# Altium schematic sheet Schematic5.SchDoc
size A4
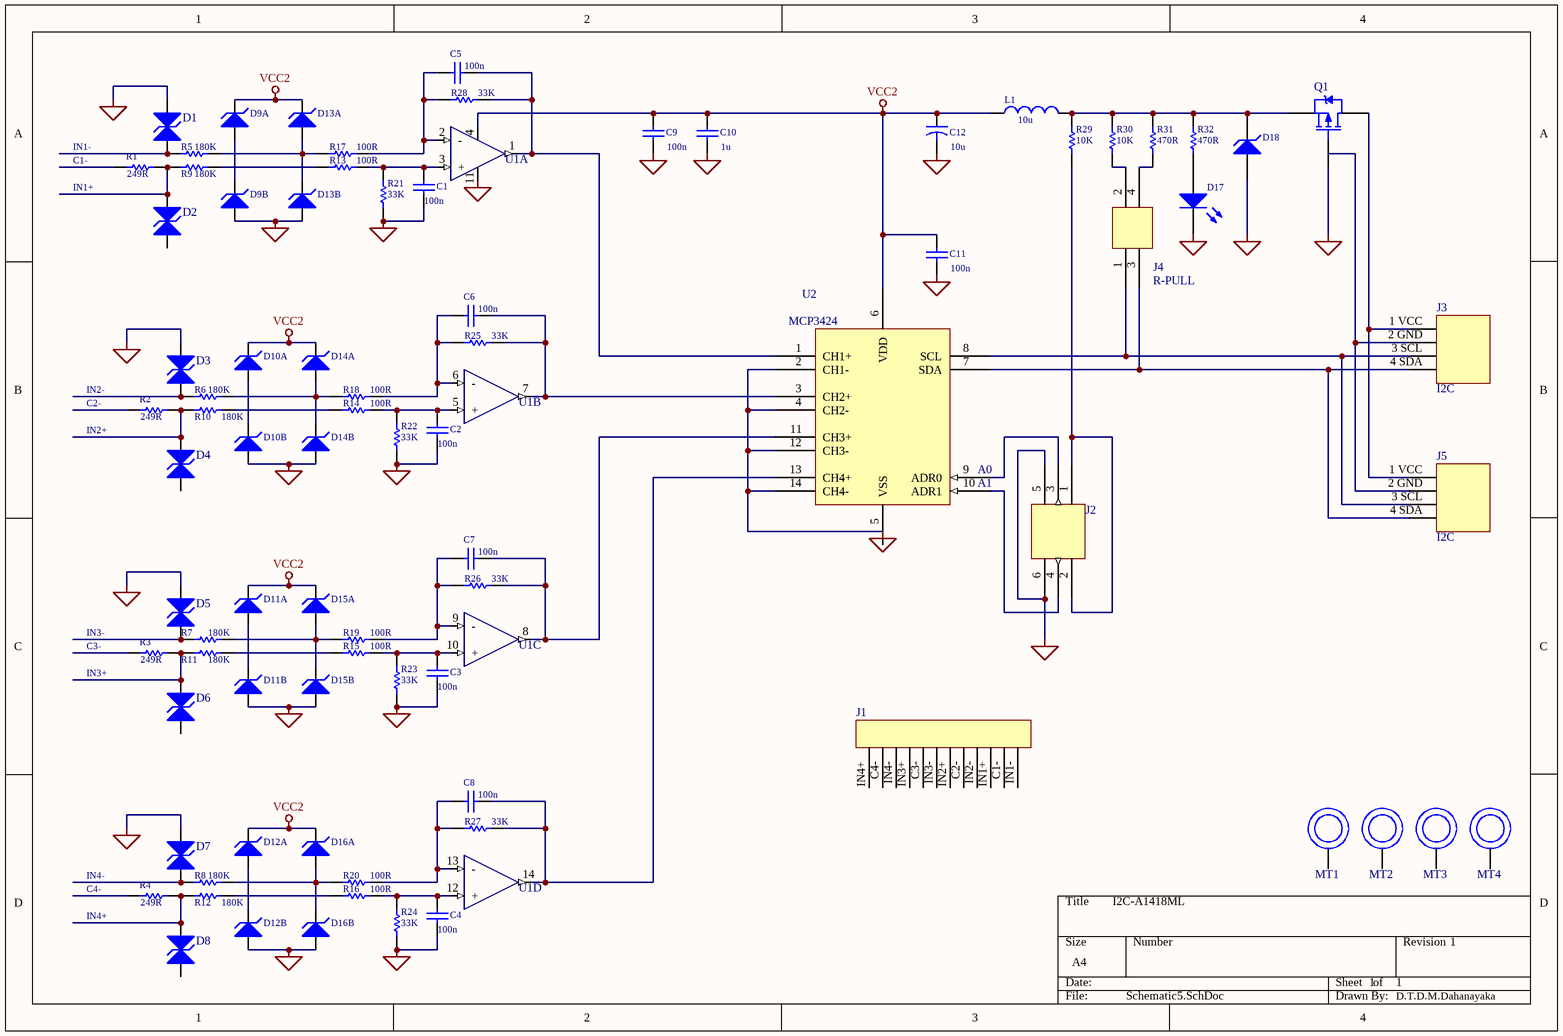
[diagram p0: Schematic5.SchDoc]

## Parts
C1  value 100n  [RAD-0.3]  (hidden comment: Cap)
C2  value 100n  [RAD-0.3]  (hidden comment: Cap)
C3  value 100n  [RAD-0.3]  (hidden comment: Cap)
C4  value 100n  [RAD-0.3]  (hidden comment: Cap)
C5  value 100n  [RAD-0.3]
C6  value 100n  [RAD-0.3]
C7  value 100n  [RAD-0.3]
C8  value 100n  [RAD-0.3]
C9  value 100n  [RAD-0.3]  (hidden comment: Cap)
C10  value 1u  [RAD-0.3]  (hidden comment: Cap)
C11  value 100n  [RAD-0.3]  (hidden comment: Cap)
C12  value 10u  [CAPR5-4X5]  (hidden comment: Cap2)
D1  (no value)  [DO-41B]
D2  (no value)  [DO-41B]
D3  (no value)  [DO-41B]
D4  (no value)  [DO-41B]
D5  (no value)  [DO-41B]
D6  (no value)  [DO-41B]
D7  (no value)  [DO-41B]
D8  (no value)  [DO-41B]
D9A  (no value)  [DO-41B]
D9B  (no value)  [DO-41B]
D10A  (no value)  [DO-41B]
D10B  (no value)  [DO-41B]
D11  ZY150  [DO-41B]  (value not drawn)
D11A  (no value)  [DO-41B]
D11B  (no value)  [DO-41B]
D12A  (no value)  [DO-41B]
D12B  (no value)  [DO-41B]
D13A  (no value)  [DO-41B]
D13B  (no value)  [DO-41B]
D14A  (no value)  [DO-41B]
D14B  (no value)  [DO-41B]
D15A  (no value)  [DO-41B]
D15B  (no value)  [DO-41B]
D16A  (no value)  [DO-41B]
D16B  (no value)  [DO-41B]
D17  LED1  [LED-1]  (value not drawn)
D18  (no value)  [DO-41B]
D22  (no value)  [DO-41B]
D33  ZY150  [DO-41B]  (value not drawn)
D44  (no value)  [DO-41B]
D55  ZY150  [DO-41B]  (value not drawn)
D66  (no value)  [DO-41B]
D77  ZY150  [DO-41B]  (value not drawn)
D88  (no value)  [DO-41B]
J1  (no value)
J2  (no value)
J3  I2C
J4  R-PULL
J5  I2C
L1  value 10u  [0402-A]  (hidden comment: Inductor)
MT1  Component_1  (value not drawn)
MT2  (no value)
MT3  (no value)
MT4  (no value)
Q1  (no value)  [TO-220AB]
R1  value 249R  [AXIAL-0.3]
R2  value 249R  [AXIAL-0.3]
R3  value 249R  [AXIAL-0.3]
R4  value 249R  [AXIAL-0.3]
R5  value 180K  [AXIAL-0.3]
R6  value 180K  [AXIAL-0.3]
R7  value 180K  [AXIAL-0.3]
R8  value 180K  [AXIAL-0.3]
R9  value 180K  [AXIAL-0.3]
R10  value 180K  [AXIAL-0.3]
R11  value 180K  [AXIAL-0.3]
R12  value 180K  [AXIAL-0.3]
R13  value 100R  [AXIAL-0.3]
R14  value 100R  [AXIAL-0.3]
R15  value 100R  [AXIAL-0.3]
R16  value 100R  [AXIAL-0.3]
R17  value 100R  [AXIAL-0.3]
R18  value 100R  [AXIAL-0.3]
R19  value 100R  [AXIAL-0.3]
R20  value 100R  [AXIAL-0.3]
R21  value 33K  [AXIAL-0.3]
R22  value 33K  [AXIAL-0.3]
R23  value 33K  [AXIAL-0.3]
R24  value 33K  [AXIAL-0.3]
R25  value 33K  [AXIAL-0.3]
R26  value 33K  [AXIAL-0.3]
R27  value 33K  [AXIAL-0.3]
R28  value 33K  [AXIAL-0.3]
R29  value 10K  [AXIAL-0.3]
R30  value 10K  [AXIAL-0.3]
R31  value 470R  [AXIAL-0.3]
R32  value 470R  [AXIAL-0.3]
U1A  (no value)
U1B  (no value)
U1C  (no value)
U1D  (no value)
U2  MCP3424

## Nets
NetC1_1: C1.1 C2.1 C3.1 C4.1 C9.1 C10.1 C11.1 C12.2 D1.1(A) D3.1(A) D5.1(A) D7.1(A) D9B.1(A) D10B.1(A) D11B.1(A) D12B.1(A) D13B.1(A) D14B.1(A) D15B.1(A) D16B.1(A) D17.2(K) D18.1(A) J2.5 J2.6 Q1.1(G) R21.1 R22.1 R23.1 R24.1 U1A.11 U2.2(CH1-) U2.4(CH2-) U2.12(CH3-) U2.14(CH4-)
VCC2: C9.2 C10.2 C11.2 C12.1 D9A.2(K) D10A.2(K) D11A.2(K) D12A.2(K) D13A.2(K) D14A.2(K) D15A.2(K) D16A.2(K) L1.1 U1A.4 U2.6(VDD)
NetC1_2: C1.2 R13.2 R21.2 U1A.3(+)
NetC2_2: C2.2 R14.2 R22.2 U1B.5(+)
NetC3_2: C3.2 R15.2 R23.2 U1C.10(+)
NetC4_2: C4.2 R16.2 R24.2 U1D.12(+)
NetC5_1: C5.1 R17.2 R28.1 U1A.2(-)
NetC5_2: C5.2 R28.2 U1A.1 U2.1(CH1+)
NetC6_1: C6.1 R18.2 R25.1 U1B.6(-)
NetC6_2: C6.2 R25.2 U1B.7 U2.3(CH2+)
NetC7_1: C7.1 R19.2 R26.1 U1C.9(-)
NetC7_2: C7.2 R26.2 U1C.8 U2.11(CH3+)
NetC8_1: C8.1 R20.2 R27.1 U1D.13(-)
NetC8_2: C8.2 R27.2 U1D.14 U2.13(CH4+)
NetD1_2: D1.2(K) D11.2(K)
NetD2_1: D2.1(A) R1.2 R9.1
NetD3_2: D3.2(K) D33.2(K)
NetD4_1: D4.1(A) R2.2 R10.1
NetD5_2: D5.2(K) D55.2(K)
NetD6_1: D6.1(A) R3.2 R11.1
NetD7_2: D7.2(K) D77.2(K)
NetD8_1: D8.1(A) R4.2 R12.1
NetD9A_1: D9A.1(A) D9B.2(K)
NetD10A_1: D10A.1(A) D10B.2(K)
NetD11_1: D11.1(A) R5.1
NetD11A_1: D11A.1(A) D11B.2(K)
NetD12A_1: D12A.1(A) D12B.2(K)
NetD13A_1: D13A.1(A) D13B.2(K) R5.2 R17.1
NetD14A_1: D14A.1(A) D14B.2(K) R6.2 R18.1
NetD15A_1: D15A.1(A) D15B.2(K) R7.2 R19.1
NetD16A_1: D16A.1(A) D16B.2(K) R8.2 R20.1
NetD17_1: D17.1(A) R32.1
NetD18_2: D18.2(K) L1.2 Q1.3(S) R29.2 R30.2 R31.2 R32.2
NetD33_1: D33.1(A) R6.1
NetD55_1: D55.1(A) R7.1
NetD77_1: D77.1(A) R8.1
NetJ2_1: J2.1 J2.2 R29.1
NetJ2_3: J2.3 U2.9(ADR0)
NetJ2_4: J2.4 U2.10(ADR1)
NetJ3_1 VCC: J3.1_VCC J5.1_VCC Q1.2(D)
NetJ3_2 GND: J3.2_GND J5.2_GND
NetJ3_3 SCL: J3.3_SCL J4.1 J5.3_SCL U2.8(SCL)
NetJ3_4 SDA: J3.4_SDA J4.3 J5.4_SDA U2.7(SDA)
NetJ4_2: J4.2 R30.1
NetJ4_4: J4.4 R31.1
NetR9_2: R9.2 R13.1
NetR10_2: R10.2 R14.1
NetR11_2: R11.2 R15.1
NetR12_2: R12.2 R16.1

Not connected (* = marked no-connect by the designer): D2 2(K); D4 2(K); D6 2(K); D8 2(K); D22 1(A) 2(K); D44 1(A) 2(K); D66 1(A) 2(K); D88 1(A) 2(K); J1 C1- C2- C3- C4- IN1+ IN1- IN2+ IN2- IN3+ IN3- IN4+ IN4-; MT1 ?1; MT2 ?1; MT3 ?1; MT4 ?1; R1 1; R2 1; R3 1; R4 1; U2 5(VSS)

## Notes on the sheet
- (near R1) IN1-
- (near R1) C1-
- (near R1) IN1+
- (near R2) IN2-
- (near R2) C2-
- (near R2) IN2+
- (near U2) A0
- (near U2) A1
- (near R3) IN3-
- (near R3) C3-
- (near R3) IN3+
- (near R4) IN4-
- (near R4) C4-
- (near R4) IN4+
- I2C-A1418ML
- 1
- D.T.D.M.Dahanayaka

## Library data of the parts
C1-C11 = Cap: Capacitor; Published: 8-Jun-2000; LatestRevisionDate: 17-Jul-2002; LatestRevisionNote: Re-released for DXP Platform.; PackageReference: RAD-0.3; Publisher: Altium Limited; PackageDescription: Radial Cap, Thru-Hole; 2 Leads; 0.3 in Pin Spacing
C12 = Cap2: Capacitor; Published: 23-Sep-2002; PackageReference: CAPR5-4X5; Publisher: Altium Limited; PackageDescription: Capacitor; 2 Leads
D1-D8 D9A D9B D10A D10B D11 D11A D11B D12A D12B D13A D13B D14A D14B D15A D15B D16A D16B D18 D22 D33 D44 D55 D66 D77 D88 = ZY150: Silicon Power Zener Diode; Published: 8-Jun-2000; LatestRevisionDate: 17-Jul-2002; LatestRevisionNote: Re-released for DXP Platform.; DatasheetDocument: 16-May-1997; PackageReference: DO-41B; Publisher: Altium Limited; Code_JEDEC: DO-204-AL; ComponentLink1Description: Manufacturer Link; ComponentLink1URL: http://www.vishay.com/
D17 = LED1: Typical RED GaAs LED; Published: 8-Jun-2000; LatestRevisionDate: 08-Jul-2005; LatestRevisionNote: Mech Layer 1 removed.; PackageReference: LED-1; Publisher: Altium Limited; PackageDescription: LED; 2 Leads
J1-J5 MT2-MT4 U1A U1B U1C U1D U2 = Component_1
L1 = Inductor: Code_IEC: 1005; Published: 8-Jun-2000; LatestRevisionDate: 29-May-2009; LatestRevisionNote: IPC-7351 Footprint Added.; PackageReference: 0402-A; Publisher: Altium Limited; PackageDescription: Chip Inductor; Code_JEITA: 0402
Q1 = PMOS-2: P-Channel Power MOSFET; Note: Pin 4 not drawn and electrically connected to Pin 2.; Published: 8-Jun-2000; LatestRevisionDate: 17-Jul-2002; LatestRevisionNote: Re-released for DXP Platform.; DatasheetVersion: PD-9.390D; PackageVersion: Feb-1997; PackageReference: TO-220AB; Publisher: Altium Limited; PackageDescription: TO, Thru-Hole, Vertical, Heatsink Mounted; 3 In-Line Leads; Pitch 2.54 mm; ComponentLink1Description: Manufacturer Link; ComponentLink1URL: http://www.irf.com/
R1-R32 = Res1: Resistor; Published: 8-Jun-2000; LatestRevisionDate: 17-Jul-2002; LatestRevisionNote: Re-released for DXP Platform.; PackageReference: AXIAL-0.3; Publisher: Altium Limited; PackageDescription: Axial Device, Thru-Hole; 2 Leads; 0.3 in Pin Spacing